# EAGLE design Carrier Board_PIR (EAGLE 8.4.3)

## Sheet 1 of 3: Sensors
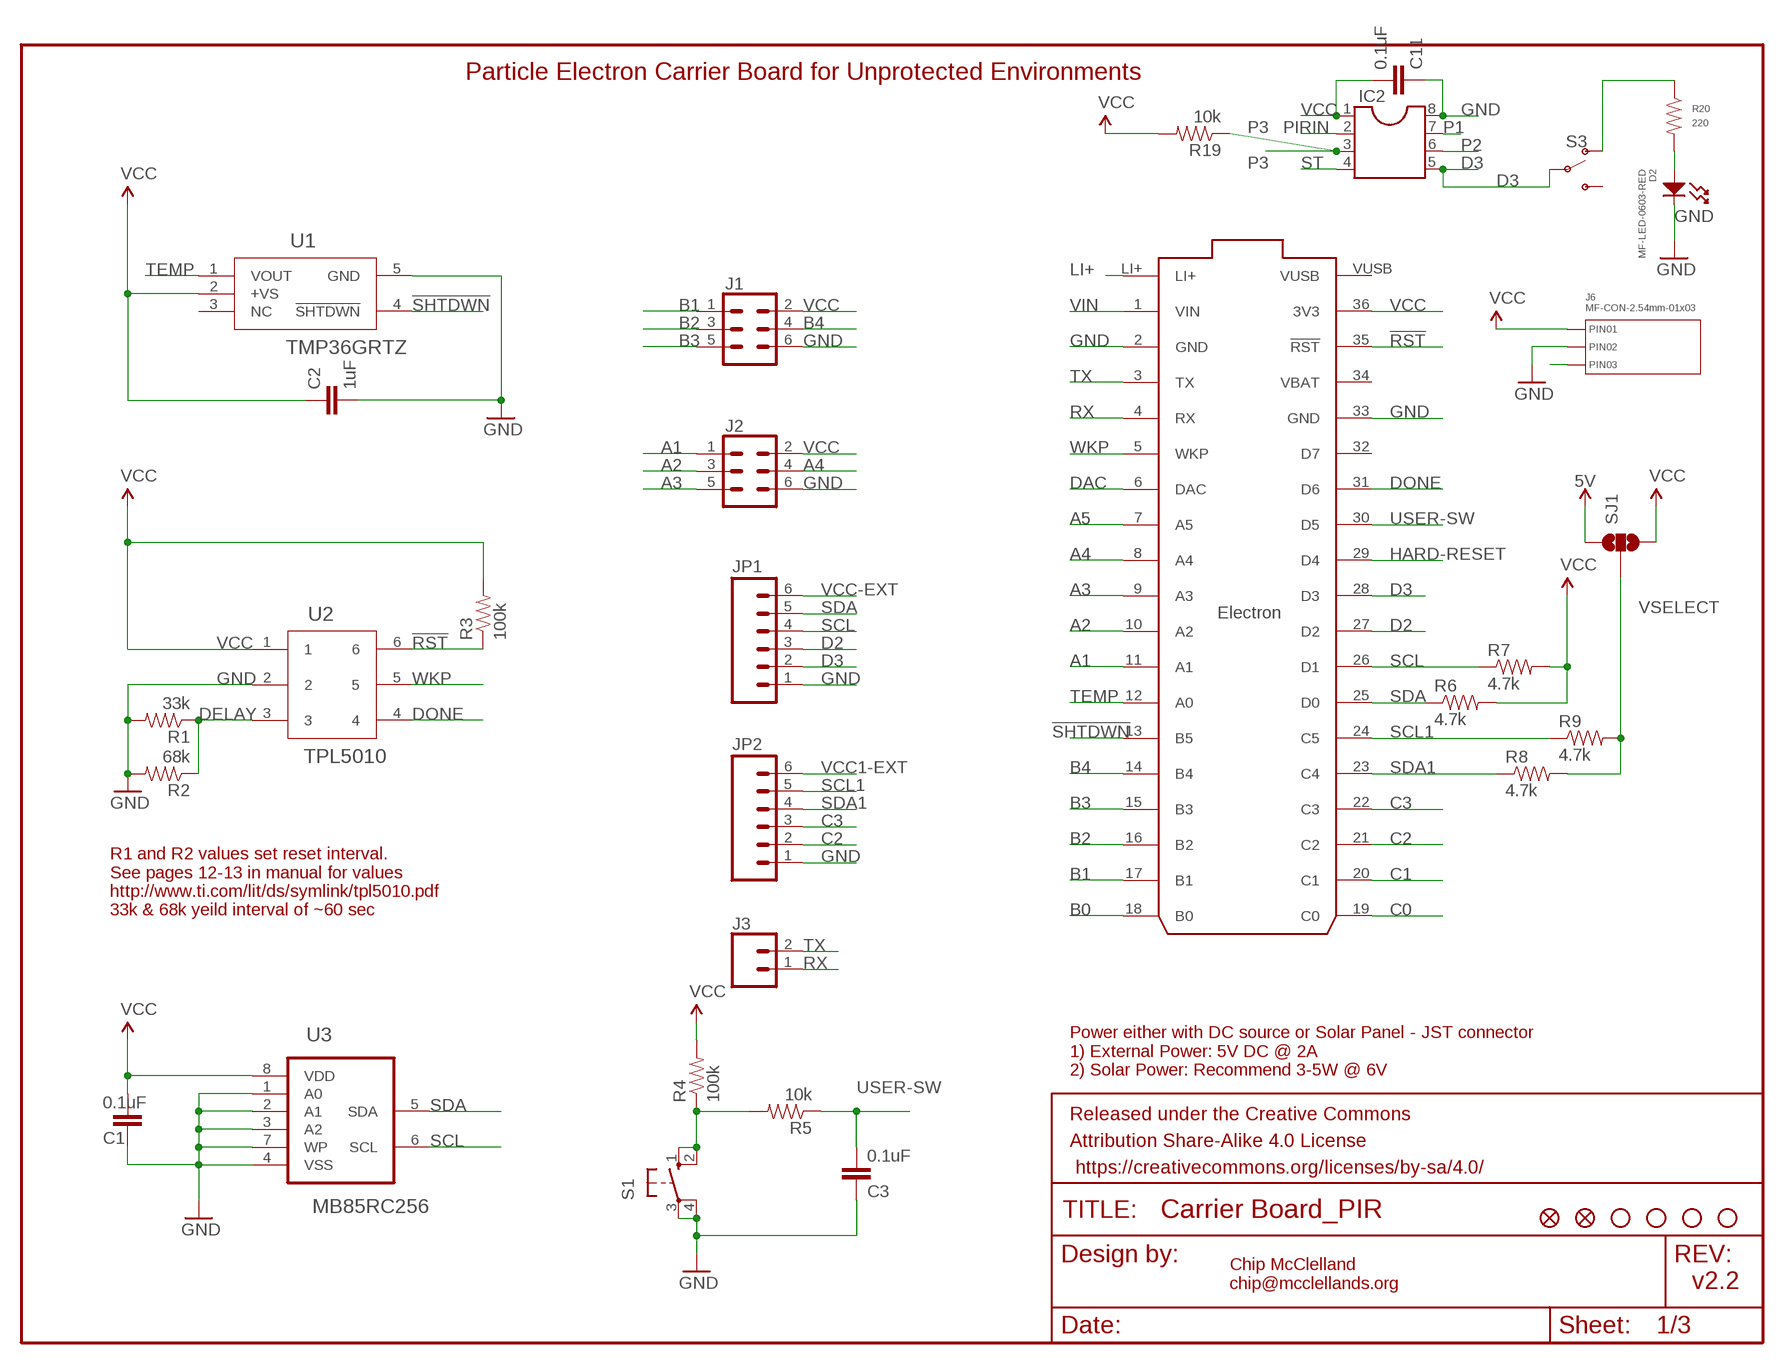
[diagram p0: schematic, sheet 1]

### Parts
C1  0.1uF  CAP0805  [0805]
C2  1uF  CAP0805  [0805]
C3  0.1uF  CAP0805  [0805]
C11  0.1uF  CAP0805  [0805]
D2  MF-LED-0603-RED  LED_SINGLE-0603-RED  [LED0603]
FD1  FIDUCIALUFIDUCIAL  [FIDUCIAL-MICRO]
FD2  FIDUCIALUFIDUCIAL  [FIDUCIAL-MICRO]
FRAME1  FRAME-LETTER  [CREATIVE_COMMONS]
IC2  DIL8S  [SOCKET-08]
J1  CONN_03X22X3_SILK_MALE_PTH  [2X3]
J2  CONN_03X22X3_SILK_MALE_PTH  [2X3]
J3  CONN_02  [1X02]
J6  MF-CON-2.54mm-01x03  CON_01X03_PTH_2.54MM  [PTH_2.54MM_01X03]
JP1  M06LOCK  [1X06_LOCK]
JP2  M06LOCK  [1X06_LOCK]
JP3  STAND-OFF  [STAND-OFF]
JP4  STAND-OFF  [STAND-OFF]
JP5  STAND-OFF  [STAND-OFF]
JP6  STAND-OFF  [STAND-OFF]
R1  33k  RESISTOR0805-RES  [0805]
R2  68k  RESISTOR0805-RES  [0805]
R3  100k  RESISTOR0805-RES  [0805]
R4  100k  RESISTOR0805-RES  [0805]
R5  10k  RESISTOR0805-RES  [0805]
R6  4.7k  RESISTOR0805-RES  [0805]
R7  4.7k  RESISTOR0805-RES  [0805]
R8  4.7k  RESISTOR0805-RES  [0805]
R9  4.7k  RESISTOR0805-RES  [0805]
R19  10k  RESISTOR0805-RES  [0805]
R20  220  RESISTOR_0603  [R0603]
S1  10-XX  [B3F-10XX]
S3  SWITCH-SPDT-SMD-RIGHT-ANGLE  [SWITCH_SPST_SMD_A]
SJ1  SOLDERJUMPER_2WAYPASTE1&2  [SJ_3_PASTE1&2]
U1  TMP36GRTZ  TMP36GRTZ-REEL7  [RJ_5]
U2  TPL5010  [TSOT-23]
U3  MB85RC256  MB85RC128PNF-G-JNE1  [SOIC127P600X175-8N]
U4  Particle Electron  ELECTRON-PWR-PINS  [ELECTON-PWR-PINS]

### Nets
5V: SJ1.1 ; also sheet 3
!RST: R3.1 U2.6 U4.35(!RST)
!SHTDWN: U1.4(!SHTDWN) U4.13(B5)
A1: J2.1 U4.11(A1)
A2: J2.3 U4.10(A2)
A3: J2.5 U4.9(A3)
A4: J2.4 U4.8(A4)
A5: U4.7(A5)
B0: U4.18(B0)
B1: J1.1 U4.17(B1)
B2: J1.3 U4.16(B2)
B3: J1.5 U4.15(B3)
B4: J1.4 U4.14(B4)
C0: U4.19(C0)
C1: U4.20(C1)
C2: JP2.2 U4.21(C2) ; also sheet 3
C3: JP2.3 U4.22(C3) ; also sheet 3
D2: JP1.3 U4.27(D2) ; also sheet 3
D3: IC2.5 JP1.2 S3.2(P) U4.28(D3) ; also sheet 3
DAC: U4.6(DAC)
DELAY: R1.1 R2.1 U2.3
DONE: U2.4 U4.31(D6)
GND: C1.2 C2.2 C3.2 C11.2 D2.CATHODE IC2.8 J1.6 J2.6 J6.P$2(PIN2) JP1.1 JP2.1 R1.2 R2.2 S1.3(P) S1.4(P1) U1.5(GND) U2.2 U3.1(A0) U3.2(A1) U3.3(A2) U3.4(VSS) U3.7(WP) U4.2(GND) U4.33(GND) ; also sheet 2,3
HARD-RESET: U4.29(D4) ; also sheet 2
LI+: U4.LI+ ; also sheet 2
N$4: R4.1 R5.2 S1.1(S) S1.2(S1)
N$5: R20.P$1 S3.1(O)
N$6: D2.ANODE R20.P$2
P1: IC2.7
P2: IC2.6
P3: IC2.3 R19.1
PIRIN: IC2.2 J6.P$3(PIN3)
RX: J3.1 U4.4(RX)
SCL: JP1.4 R7.1 U3.6(SCL) U4.26(D1) ; also sheet 3
SCL1: JP2.5 R9.1 U4.24(C5) ; also sheet 3
SDA: JP1.5 R6.1 U3.5(SDA) U4.25(D0) ; also sheet 3
SDA1: JP2.4 R8.1 U4.23(C4) ; also sheet 3
ST: IC2.4
TEMP: U1.1(VOUT) U4.12(A0)
TX: J3.2 U4.3(TX)
USER-SW: C3.1 R5.1 U4.30(D5)
VCC: C1.1 C2.1 C11.1 IC2.1 J1.2 J2.2 J6.P$1(PIN1) R3.2 R4.2 R6.2 R7.2 R19.2 SJ1.3 U1.2(+VS) U2.1 U3.8(VDD) U4.36(3V3) ; also sheet 3
VCC1-EXT: JP2.6 ; also sheet 3
VCC-EXT: JP1.6 ; also sheet 3
VIN: U4.1(VIN) ; also sheet 2
VSELECT: R8.2 R9.2 SJ1.2 ; also sheet 3
WKP: U2.5 U4.5(WKP)
Unconnected: S3.3(S) U1.3(NC) U4.32(D7) U4.VUSB

### Notes on the sheet
- Particle Electron Carrier Board for Unprotected Environments
- R1 and R2 values set reset interval.
  See pages 12-13 in manual for values
  http://www.ti.com/lit/ds/symlink/tpl5010.pdf
  33k & 68k yeild interval of ~60 sec
- Power either with DC source or Solar Panel - JST connector
  1) External Power: 5V DC @ 2A 
  2) Solar Power: Recommend 3-5W @ 6V
- Chip McClelland
  chip@mcclellands.org
- v2.2

## Sheet 2 of 3: Power Control
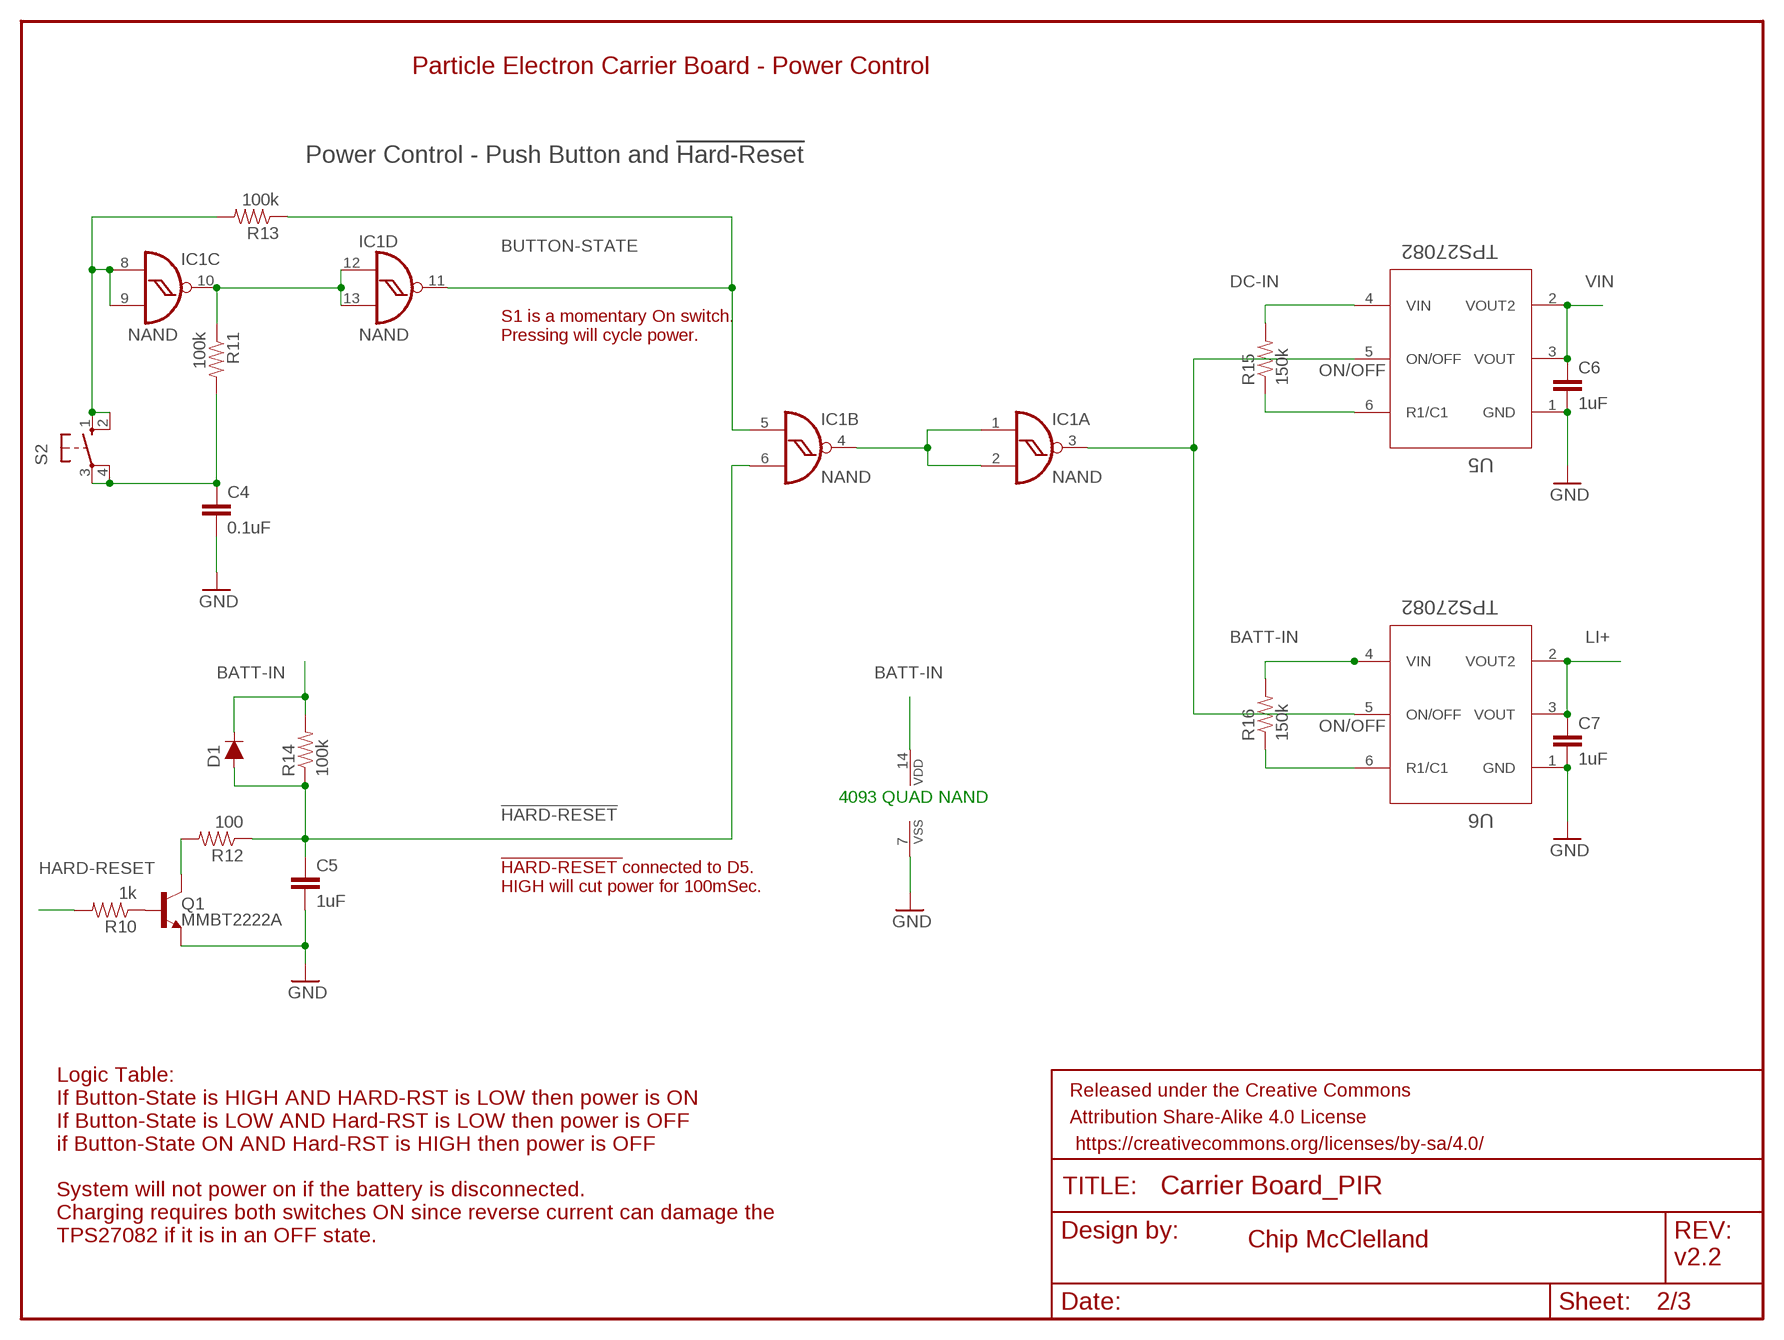
[diagram p1: schematic, sheet 2]

### Parts
C4  0.1uF  CAP0805  [0805]
C5  1uF  CAP0805  [0805]
C6  1uF  CAP0805  [0805]
C7  1uF  CAP0805  [0805]
D1  DIODE-BAS16J  [SOD-323]
FRAME2  FRAME-LETTER  [CREATIVE_COMMONS]
IC1  NAND  4093DT  [MC14093B-TSSOP14]
Q1  MMBT2222A  TRANS_NPN-MMBT2222AL  [SOT23-3]
R10  1k  RESISTOR0805-RES  [0805]
R11  100k  RESISTOR0805-RES  [0805]
R12  100  RESISTOR0805-RES  [0805]
R13  100k  RESISTOR0805-RES  [0805]
R14  100k  RESISTOR0805-RES  [0805]
R15  150k  RESISTOR0805-RES  [0805]
R16  150k  RESISTOR0805-RES  [0805]
S2  40-XX-ROUND  [B3F-40XX-ROUND]
U5  TPS27082  [TSOT-23]
U6  TPS27082  [TSOT-23]

### Nets
!HARD-RESET: C5.1 D1.A IC1.6(B:I1) R12.1 R14.1
BATT-IN: D1.C IC1.14(P:VDD) R14.2 R16.2 U6.4(VIN) ; also sheet 3
BUTTON-STATE: IC1.5(B:I0) IC1.11(D:O) R13.1
DC-IN: R15.2 U5.4(VIN) ; also sheet 3
GND: C4.2 C5.2 C6.2 C7.2 IC1.7(P:VSS) Q1.2(E) U5.1(GND) U6.1(GND) ; also sheet 1,3
HARD-RESET: R10.2 ; also sheet 1
LI+: C7.1 U6.2(VOUT2) U6.3(VOUT) ; also sheet 1
N$1: IC1.1(A:I0) IC1.2(A:I1) IC1.4(B:O)
N$14: IC1.10(C:O) IC1.12(D:I0) IC1.13(D:I1) R11.1
N$15: R15.1 U5.6(R1/C1)
N$16: Q1.1(B) R10.1
N$17: R16.1 U6.6(R1/C1)
N$19: Q1.3(C) R12.2
N$24: C4.1 R11.2 S2.3(P) S2.4(P1)
N$25: IC1.8(C:I0) IC1.9(C:I1) R13.2 S2.1(S) S2.2(S1)
ON/OFF: IC1.3(A:O) U5.5(ON/OFF) U6.5(ON/OFF)
VIN: C6.1 U5.2(VOUT2) U5.3(VOUT) ; also sheet 1

### Notes on the sheet
- Particle Electron Carrier Board - Power Control
- Power Control - Push Button and !Hard-Reset
- S1 is a momentary On switch.
  Pressing will cycle power.
- 4093 QUAD NAND
- !HARD-RESET !connected to D5. 
  HIGH will cut power for 100mSec.
- Chip McClelland
- Logic Table:
  If Button-State is HIGH AND HARD-RST is LOW then power is ON
  If Button-State is LOW AND Hard-RST is LOW then power is OFF
  if Button-State ON AND Hard-RST is HIGH then power is OFF
  
  System will not power on if the battery is disconnected.  
  Charging requires both switches ON since reverse current can damage the
  TPS27082 if it is in an OFF state.
- v2.2

## Sheet 3 of 3: Protection and 5V Boost
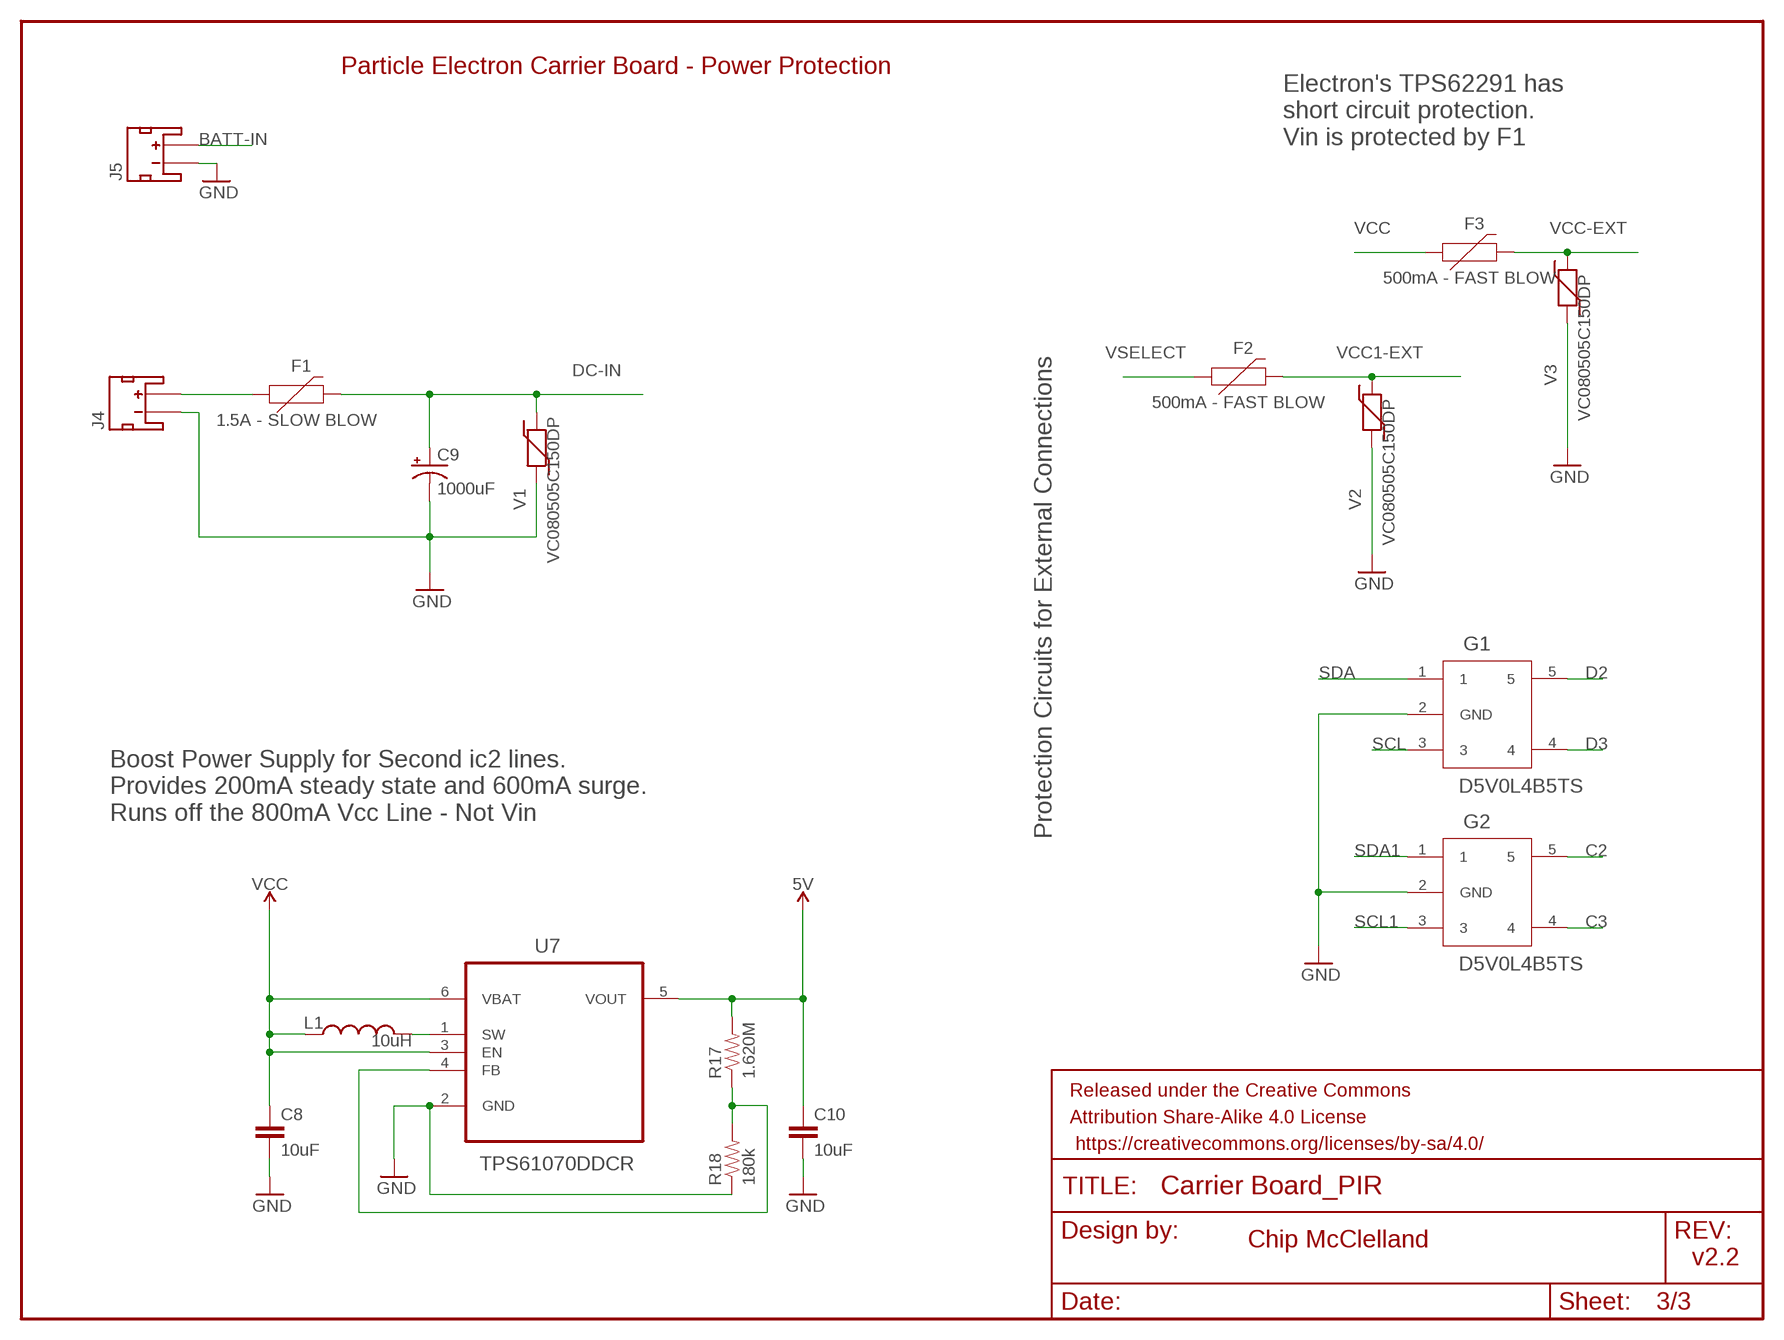
[diagram p2: schematic, sheet 3]

### Parts
C8  10uF  CAP0805  [0805]
C9  1000uF  CAP_POLG  [PANASONIC_G]
C10  10uF  CAP0805  [0805]
F1  1.5A - SLOW BLOW  PPTC_HALF-AMP  [1206]
F2  500mA - FAST BLOW  PPTC_HALF-AMP  [1206]
F3  500mA - FAST BLOW  PPTC_HALF-AMP  [1206]
FRAME3  FRAME-LETTER  [CREATIVE_COMMONS]
G1  D5V0L4B5TS  [SOT-23-5]
G2  D5V0L4B5TS  [SOT-23-5]
J4  5V @ 2A  JST_2MM_MALE  [JST-2-SMD]
J5  JST_2MM_MALE  [JST-2-SMD]
L1  10uH  INDUCTORSDR0403-560KL  [SDR0403]
R17  1.620M  RESISTOR0805-RES  [0805]
R18  180k  RESISTOR0805-RES  [0805]
U7  TPS61070DDCR  [SOT95P280X110-6N]
V1  VC080505C150DP  VARISTOR  [0805]
V2  VC080505C150DP  VARISTOR  [0805]
V3  VC080505C150DP  VARISTOR  [0805]

### Nets
5V: C10.1 R17.2 U7.5(VOUT) ; also sheet 1
BATT-IN: J5.2(+) ; also sheet 2
C2: G2.5 ; also sheet 1
C3: G2.4 ; also sheet 1
D2: G1.5 ; also sheet 1
D3: G1.4 ; also sheet 1
DC-IN: C9.+ F1.2 V1.2 ; also sheet 2
DC-IN-EXT: F1.1 J4.2(+)
GND: C8.2 C9.- C10.2 G1.2(GND) G2.2(GND) J4.1(-) J5.1(-) R18.1 U7.2(GND) V1.1 V2.1 V3.1 ; also sheet 1,2
N$2: R17.1 R18.2 U7.4(FB)
SCL: G1.3 ; also sheet 1
SCL1: G2.3 ; also sheet 1
SDA: G1.1 ; also sheet 1
SDA1: G2.1 ; also sheet 1
SW: L1.P$2 U7.1(SW)
VCC: C8.1 F3.1 L1.P$1 U7.3(EN) U7.6(VBAT) ; also sheet 1
VCC1-EXT: F2.2 V2.2 ; also sheet 1
VCC-EXT: F3.2 V3.2 ; also sheet 1
VSELECT: F2.1 ; also sheet 1
Unconnected: J4.NC1(PAD1) J4.NC2(PAD2) J5.NC1(PAD1) J5.NC2(PAD2)

### Notes on the sheet
- Particle Electron Carrier Board - Power Protection
- Electron's TPS62291 has 
  short circuit protection. 
  Vin is protected by F1
- Boost Power Supply for Second ic2 lines.
  Provides 200mA steady state and 600mA surge. 
  Runs off the 800mA Vcc Line - Not Vin
- Protection Circuits for External Connections
- Chip McClelland
- v2.2

## Power pins joined to a net without a drawn wire
VBAT: U4.34(VBAT)

## Library data of the parts
C1-C8 C10 C11 = SparkFun-Capacitors:CAP: Capacitor Standard 0603 ceramic capacitor, and 0.1" leaded capacitor.
C9 = SparkFun-Capacitors:CAP_POL: Capacitor Polarized These are standard SMD and PTH capacitors. Normally 10uF, 47uF, and 100uF in electrolytic and tantalum varieties. Always verify the external diameter of the through hole cap, it varies with capacity, voltage, and manufacturer. The EIA devices should be standard.
D1 = SparkFun-DiscreteSemi:DIODE: Diode These are standard reverse protection diodes and small signal diodes. SparkFun Products: SparkFun SparkPunk Sound Kit <https://www.sparkfun.com/products/11177> SparkFun ESP8266 Thing <https://www.sparkfun.com/products/13231>; PROD_ID: DIO-09646; VALUE: 250mA/100V
D2 = MF_LEDs:LED_SINGLE: Library: MF_LEDs Description: Device for Single LED Packages. Manufacture part number (MFG#) can be added via Attributes.; HOUSEPART: YES; MPN: MF-LED-0603-RED; POPULATE: 1; URL: https://factory.macrofab.com/part/MF-LED-0603-RED
F1-F3 = SparkFun-Fuses:PPTC: Resettable Fuse PPTC Resettable Fuse. Really a sort of resistor with a polymeric positive temperature coefficient whose resistance increases dramatically with an increase in temperature. When heated by the power passing through the resistance rises causing the current to be limited, protecting the circuit. This is achieved by the transition of the polymer from a crystalline to an amorphous state where the conductive carbon separates breaking the conductive pathways found in the cool crystalline structure. When a PPTC cools back down it resumes conducting letting the circuit turn back on. SparkFun Products: SparkFun RedBoard - Programmed with Arduino <https://www.sparkfun.com/products/12757> Pro Micro - 5V/16MHz <https://www.sparkfun.com/products/12640> Arduino Pro 328 - 5V/16MHz <https://www.sparkfun.com/products/10915> MP3 Trigger <https://www.sparkfun.com/products/13720>; PROD_ID: RES-08585; VALUE: 6V/0.5A
FD1 FD2 = SparkFun-Aesthetics:FIDUCIAL: Fiducial Alignment Points Point-of-reference for pick-and-place machines and other optical instruments.
FRAME1-FRAME3 = SparkFun-Aesthetics:FRAME-LETTER: Schematic Frame - Letter Standard 8.5x11 US Letter frame
G1 G2 = Custom Components:D5V0L4B5TS: 4 CHANNEL LOW CAPACITANCE BI-DIRECTIONAL TVS ARRAY
IC1 = adafruit:4093: Quad 2-input NAND schmitt trigger
IC2 = ic-package:DIL8: Dual In Line / Socket
J1 J2 = SparkFun-Connectors:CONN_03X2: Multi connection point. Often used as Generic Header-pin footprint for 0.1 inch spaced/style header connections You can populate with any combo of single row headers, but if you'd like an exact match, check these: Header - 2x3 (Male, 0.1") <https://www.sparkfun.com/products/12807> (PRT-12807) Header - 2x3 (Female, 0.1") <https://www.sparkfun.com/products/13010> (PRT-13010) 2x3 Pin Shrouded Header <https://www.sparkfun.com/products/10877> (PRT-10877) On any of the 0.1 inch spaced packages, you can populate with these: Break Away Headers - Straight <https://www.sparkfun.com/products/116> (PRT-00116) Break Away Male Headers - Right Angle <https://www.sparkfun.com/products/553> (PRT-00553) Female Headers <https://www.sparkfun.com/products/115> (PRT-00115) Break Away Headers - Machine Pin <https://www.sparkfun.com/products/117> (PRT-00117) Break Away Female Headers - Swiss Machine Pin <https://www.sparkfun.com/products/743> (PRT-00743) Special note: the shrouded connector mates well with our 3x2 ribbon cables: Ribbon Crimp Connector - 6-pin (2x3, Female) <https://www.sparkfun.com/products/10651> (PRT-10651) Ribbon Cable - 6 wire (15ft) <https://www.sparkfun.com/products/10646> (PRT-10646); PROD_ID: CONN-09701
J3 = SparkFun-Connectors:CONN_02: Multi connection point. Often used as Generic Header-pin footprint for 0.1 inch spaced/style header connections On any of the 0.1 inch spaced packages, you can populate with these: Break Away Headers - Straight <https://www.sparkfun.com/products/116> (PRT-00116) Break Away Male Headers - Right Angle <https://www.sparkfun.com/products/553> (PRT-00553) Female Headers <https://www.sparkfun.com/products/115> (PRT-00115) Break Away Headers - Machine Pin <https://www.sparkfun.com/products/117> (PRT-00117) Break Away Female Headers - Swiss Machine Pin <https://www.sparkfun.com/products/743> (PRT-00743) For SCREWTERMINALS and SPRING TERMINALS visit here: Screw Terimnals on SparkFun.com <https://www.sparkfun.com/search/results?term=Screw+Terminals> (5mm/3.5mm/2.54mm spacing) This device is also useful as a general connection point to wire up your design to another part of your project. Our various solder wires solder well into these plated through hole pads. Hook-Up Wire - Assortment (Stranded, 22 AWG) <https://www.sparkfun.com/products/11375> (PRT-11375) Hook-Up Wire - Assortment (Solid Core, 22 AWG) <https://www.sparkfun.com/products/11367> (PRT-11367) View the entire wire category on our website here <https://www.sparkfun.com/categories/141> Special notes: Molex polarized connector foot print use with: PRT-08233 with associated crimp pins and housings. 2.54_SCREWTERM for use with PRT-10571. 3.5mm Screw Terminal footprints for PRT-08084 5mm Screw Terminal footprints for use with PRT-08432
J4 J5 = SparkFun-Connectors:JST_2MM_MALE: JST 2MM MALE RA CONNECTOR Two pin, compact surface mount connector. Commonly used as a battery input connection point. We really like the solid locking feeling and high current rating on these small connectors. We use these all the time as battery connectors. Mates to single-cell LiPo batteries. Here is the connector we sell at SparkFun: JST Right Angle Connector - White <https://www.sparkfun.com/products/8612> (PRT-08612) Datasheet <http://www.sparkfun.com/datasheets/Prototyping/Connectors/JST-Horizontal.pdf> It was used on these SparkFun products: SparkFun MOSFET Power Controller <https://www.sparkfun.com/products/11214> (PRT-11214) SparkFun Battery Babysitter - LiPo Battery Manager <https://www.sparkfun.com/products/13777> (PRT-13777) And many, many others that required a lipo battery connection.; PROD_ID: CONN-11443; SF_ID: PRT-08612
J6 = MF_Connectors:CON_01X03: Library: MF_Connectors Description: Header Connector with 03 Positions and 01 Rows. Use the LABEL Attribute to label the pin on the schematic and PCB. You can remove the attributes on the PCB by using the SMASH function on the part and then deleting the text.; HOUSEPART: YES; MPN: MF-CON-2.54mm-01x03; POPULATE: 1; URL: https://factory.macrofab.com/part/MF-CON-2.54mm-01x03
JP1 JP2 = SparkFun-Connectors:M06: Header 6 Standard 6-pin 0.1" header. Use with straight break away headers (SKU : PRT-00116), right angle break away headers (PRT-00553), swiss pins (PRT-00743), machine pins (PRT-00117), and female headers (PRT-00115). Molex polarized connector foot print use with SKU : PRT-08094 with associated crimp pins and housings. NOTES ON THE VARIANTS LOCK and LOCK_LONGPADS... This footprint was designed to help hold the alignment of a through-hole component (i.e. 6-pin header) while soldering it into place. You may notice that each hole has been shifted either up or down by 0.005 of an inch from it's more standard position (which is a perfectly straight line). This slight alteration caused the pins (the squares in the middle) to touch the edges of the holes. Because they are alternating, it causes a "brace" to hold the component in place. 0.005 has proven to be the perfect amount of "off-center" position when using our standard breakaway headers. Although looks a little odd when you look at the bare footprint, once you have a header in there, the alteration is very hard to notice. Also,if you push a header all the way into place, it is covered up entirely on the bottom side. This idea of altering the position of holes to aid alignment will be further integrated into the Sparkfun Library for other footprints. It can help hold any component with 3 or more connection pins.
JP3-JP6 = SparkFun:STAND-OFF: Stand Off This is the mechanical footprint for a #4 phillips button head screw. Use the keepout ring to avoid running the screw head into surrounding components. SKU : PRT-00447
L1 = SparkFun-Passives:INDUCTOR: Inductors Basic Inductor/Choke - 0603 and 1206. Footprints are not proven and vary greatly between part numbers. SRN6045- 33uH, 20% 1.4A SDR0403-560KL - 56uH, 10%, 500mA RMS/740mA peak; DIST: DIGIKEY; DIST_ID: SDR0403-560KLCT-ND; VALUE: 56uH
Q1 = SparkFun-DiscreteSemi:TRANS_NPN: NPN transistor Current controlled devices typically used to amplify current or used as a switch. BC547 - COM-08928 <http://www.sparkfun.com/products/8928> (TO-92 45V 100mA) (1.Collector 2.Base 3.Emitter) 2N3904 - COM-00521 <http://www.sparkfun.com/products/521> (TO-92 40V 200mA) (1.Emitter 2.Base 3.Collector) P2N2222A - COM-12852 <http://www.sparkfun.com/products/12852> (TO-92 40V 600mA) (1.Collector 2.Base 3.Emitter); PROD_ID: TRANS-08049; VALUE: 600mA/40V
R1-R19 = SparkFun-Passives:RESISTOR: Resistor Basic schematic elements and footprints for 0603, 1206, and PTH resistors.
R20 = MF_Passives:RESISTOR: Library: MF_Passives Description: Device for Resistors. Manufacture part number (MPN), Voltage, Tolerance, and Wattage Rating can be added via Attributes. Check https://factory.macrofab.com/parts for the house parts list.; POPULATE: 1
S1 = switch-omron:10-XX: OMRON SWITCH
S2 = adafruit:40-XX: OMRON SWITCH
S3 = SparkFun-Switches:SWITCH-SPDT: Single Pole, Double Throw (SPDT) Switch Single-pole, double-throw (SPDT) switch. Variant Overview SMD-AYZ0202 Surface Mount DPDT Switch <https://www.sparkfun.com/products/597> (COM-00597) Used on e.g. LilyPad Arduino USB - ATmega32U4 Board <https://www.sparkfun.com/products/12049> PTH-11.6X4.0MM SPDT Mini Power Switch <https://www.sparkfun.com/products/102> (COM-00102) Used on e.g. SparkFun Simon Says - Through-Hole Soldering Kit <https://www.sparkfun.com/products/10547> (KIT-10547) PTH-11.6X4.0MM-KIT KIT version of SPDT Mini Power Switch - Simplifies soldering by removing tStop of switch pins - only one side can be soldered. PTH-11.6X4.0MM-LOCK LOCK version of SPDT Mini Power Switch - Offset pins hold switch in place for easier soldering. SMD-RIGHT-ANGLE Surface Mount Right Angle Switch <https://www.sparkfun.com/products/10860> (COM-10860) Used on e.g. SparkFun ESP8266 Thing <https://www.sparkfun.com/products/13231>; PROD_ID: SWCH-10651; SF_SKU: COM-10860
SJ1 = SparkFun-Passives:SOLDERJUMPER_2WAY: Solder Jumper 2 way solder jumper
U1 = TMP36:TMP36GRTZ-REEL7; MANUFACTURER_PART_NUMBER: TMP36GRTZREEL7; VENDOR: Analog Devices Inc
U2 = Custom Components:TPL5010
U3 = Fujitsu_By_element14_Batch_1:MB85RC128PNF-G-JNE1: Memory FRAM; MPN: MB85RC128PNF-G-JNE1; OC_FARNELL: 1831995; OC_NEWARK: 93R5161; PACKAGE: SO-8; SUPPLIER: FUJITSU
U4 = Particle-Devices:ELECTRON-PWR-PINS: This is a Electron pinout with the two power pins populated
U5 U6 = Custom Components:TPS27082: TI TPS27082 Single High-Side On-Off Switch
U7 = Texas Instruments_By_element14_Batch_1:TPS61070DDCR: SYNCHRONOUS BOOST CONVERTER; MPN: TPS61070DDCR; OC_FARNELL: 1461062; OC_NEWARK: 64M3125; PACKAGE: SOT-23-6; SUPPLIER: Texas Instruments
V1-V3 = Custom Components:VARISTOR

## Net classes
0 default: width 0.203 mm, drill 0.33 mm

## Board
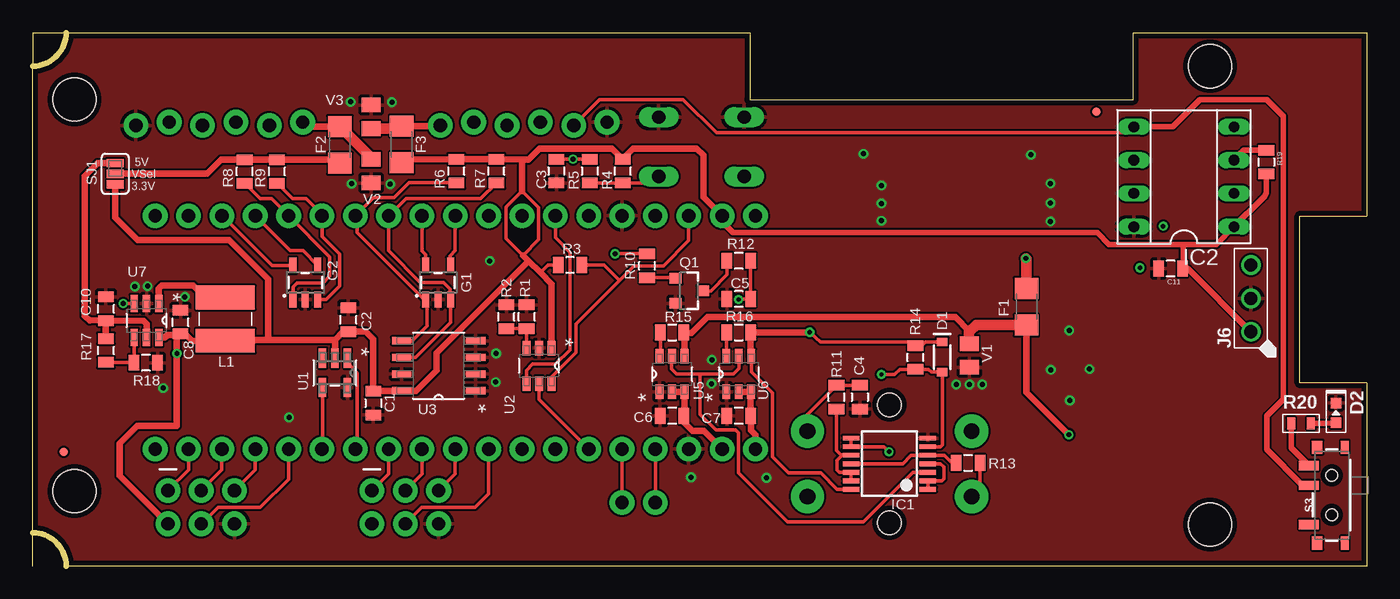
[diagram p3: board, top side]
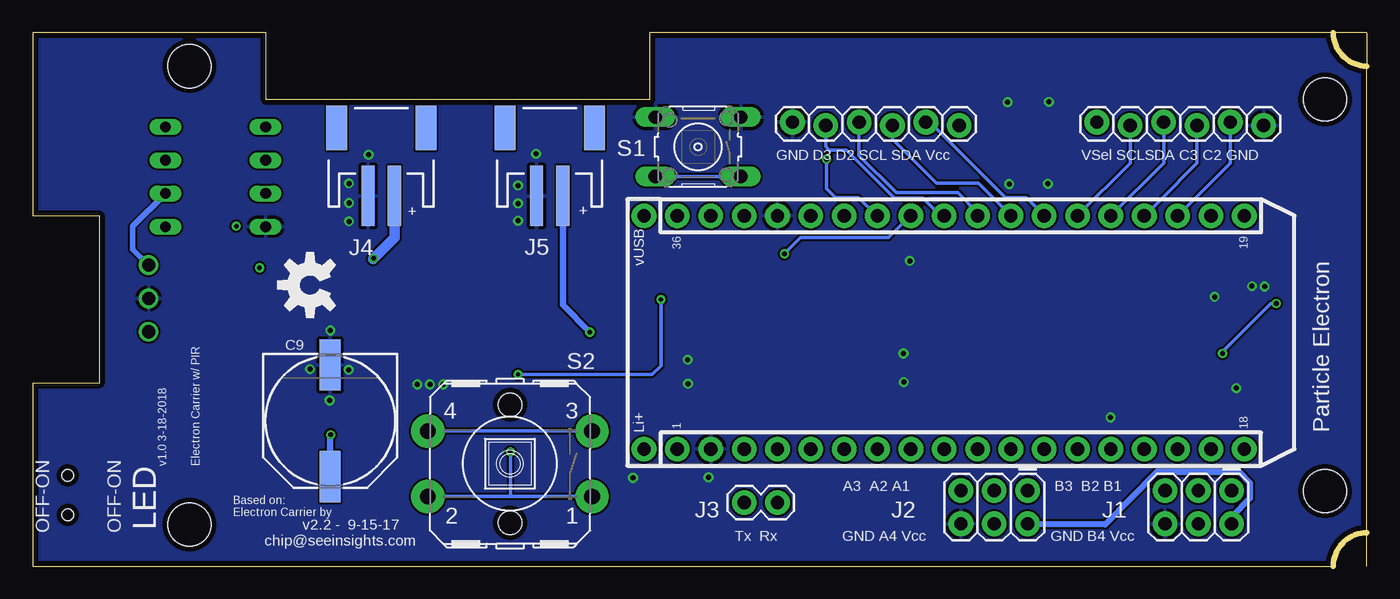
[diagram p4: board, bottom side, seen from below]

Size 101.6 x 40.64 mm. Coordinates in mm from the lower left corner, seen from the top.
Outline: 0,40.62 0,38.1
Outline: 0,0 0,2.54
Outline: 0,2.54 0,38.1
Outline: 0,40.64 2.54,40.64
Outline: 2.54,40.64 54.61,40.64 54.61,35.56 83.82,35.56 83.82,40.64 101.6,40.64 101.6,26.67 96.52,26.67 96.52,13.97 101.6,13.97 101.6,0 2.54,0 arc90 0,2.54
Outline: 0,38.1 arc90 2.54,40.64
Copper layers (1*16): Top 0.0356mm / dielectric 1.5011mm / Bottom 0.0356mm
Design rules "LaenPCBOrder": minimum track width 6mil, minimum drill 13mil, track to track 6mil, track to pad 6mil, pad to pad 6mil, via to via 6mil, smd to smd 6mil, copper to edge 15mil, drill to drill 6mil, minimum pad ring 7mil, minimum via ring 7mil, stop-mask expansion 3mil, vias tented up to drill 0mil, thermal gap 10mil

### Footprints (pad centres in the part's own frame; a part is rotated, then mirrored left to right if it is on the bottom)
0805 = smd 0.8 x 1.2: 1 -0.9,0; 2 0.9,0
PANASONIC_G = smd 3.9 x 1.6: + 4.25,0; - -4.25,0
SOD-323 = smd 0.63 x 0.83: A 1.15,0; C -1.15,0
LED0603 = smd 0.8 x 0.8: ANODE 0.75,0; CATHODE -0.75,0
1206 = smd 1.6 x 1.8: 1 -1.4,0; 2 1.4,0
FIDUCIAL-MICRO = smd 0.635 x 0.635: 1 0,0
SOT-23-5 = smd 0.55 x 1.2: 1 -0.95,-1.3; 2 0,-1.3; 3 0.95,-1.3; 4 0.95,1.3; 5 -0.95,1.3
MC14093B-TSSOP14 = smd 0.36 x 1.26: 1 -1.95,-2.925; 2 -1.3,-2.925; 3 -0.65,-2.925; 4 0,-2.925; 5 0.65,-2.925; 6 1.3,-2.925; 7 1.95,-2.925; 8 1.95,2.925; 9 1.3,2.925; 10 0.65,2.925; 11 0,2.925; 12 -0.65,2.925; 13 -1.3,2.925; 14 -1.95,2.925
SOCKET-08 = drill 0.813 long: 1 -3.81,-3.81; 2 -1.27,-3.81; 3 1.27,-3.81; 4 3.81,-3.81; 5 3.81,3.81; 6 1.27,3.81; 7 -1.27,3.81; 8 -3.81,3.81
2X3 = drill 1.016 pad 1.88: 1 0,0; 2 0,2.54; 3 2.54,0; 4 2.54,2.54; 5 5.08,0; 6 5.08,2.54
1X02 = drill 1.016 pad 1.88: 1 0,0; 2 2.54,0
JST-2-SMD = smd 1 x 4.6: 1 -1,-3.7; 2 1,-3.7 | smd 1.6 x 3.4: NC1 -3.4,1.5; NC2 3.4,1.5
PTH_2.54MM_01X03 = drill 1: P$1 -2.54,0; P$2 0,0; P$3 2.54,0
1X06_LOCK = drill 1.016 pad 1.88: 1 0,0; 2 2.54,-0.254; 3 5.08,0; 4 7.62,-0.254; 5 10.16,0; 6 12.7,-0.254
STAND-OFF = hole 3.302: 0,0
SDR0403 = smd 1.8 x 4.5: P$1 -1.65,0; P$2 1.65,0
SOT23-3 = smd 0.8 x 0.9: 1 -0.95,-1; 2 0.95,-1; 3 0,1.1
R0603 = smd 0.6 x 0.9: P$1 -0.75,0; P$2 0.75,0
B3F-10XX = drill 1.016 long: 1 -3.251,2.261; 2 3.251,2.261; 3 -3.251,-2.261; 4 3.251,-2.261
B3F-40XX-ROUND = drill 1.194 pad 2.54: 1 -6.248,2.489; 2 6.248,2.489; 3 -6.248,-2.489; 4 6.248,-2.489 | hole 1.803: 0,-4.496; 0,4.496
SWITCH_SPST_SMD_A = smd 0.7 x 1.5: 1 -2.25,-1.75; 2 -0.75,-1.75; 3 2.25,-1.75 | smd 1 x 0.6: GND1 -3.65,1; GND3 3.65,1 | smd 1 x 0.8: GND2 -3.65,-1.1; GND4 3.65,-1.1 | hole 0.9: -1.5,0; 1.5,0
SJ_3_PASTE1&2 = smd 0.635 x 1.27: 1 -0.813,0; 2 0,0; 3 0.813,0
RJ_5 = smd 1.473 x 0.559: 1 -1.118,0.95; 2 -1.118,0; 3 -1.118,-0.95; 4 1.118,-0.95; 5 1.118,0.95
TSOT-23 = smd 1.1 x 0.6: 1 -1.35,0.95; 2 -1.35,0; 3 -1.35,-0.94; 4 1.35,-0.95; 5 1.35,0; 6 1.35,0.95
SOIC127P600X175-8N = smd 1.473 x 0.559: 1 -2.819,1.905; 2 -2.819,0.635; 3 -2.819,-0.635; 4 -2.819,-1.905; 5 2.819,-1.905; 6 2.819,-0.635; 7 2.819,0.635; 8 2.819,1.905
ELECTON-PWR-PINS = drill 1.016 pad 1.88: 1 2.54,46.99; 2 2.54,44.45; 3 2.54,41.91; 4 2.54,39.37; 5 2.54,36.83; 6 2.54,34.29; 7 2.54,31.75; 8 2.54,29.21; 9 2.54,26.67; 10 2.54,24.13; 11 2.54,21.59; 12 2.54,19.05; 13 2.54,16.51; 14 2.54,13.97; 15 2.54,11.43; 16 2.54,8.89; 17 2.54,6.35; 18 2.54,3.81; 19 20.32,3.81; 20 20.32,6.35; 21 20.32,8.89; 22 20.32,11.43; 23 20.32,13.97; 24 20.32,16.51; 25 20.32,19.05; 26 20.32,21.59; 27 20.32,24.13; 28 20.32,26.67; 29 20.32,29.21; 30 20.32,31.75; 31 20.32,34.29; 32 20.32,36.83; 33 20.32,39.37; 34 20.32,41.91; 35 20.32,44.45; 36 20.32,46.99; LI+ 2.54,49.53; VUSB 20.32,49.53
SOT95P280X110-6N = smd 1.321 x 0.559: 1 -1.295,0.94; 2 -1.295,0; 3 -1.295,-0.94; 4 1.295,-0.94; 5 1.295,0; 6 1.295,0.94
0805' = smd 1.118 x 1.448: 1 -0.902,0; 2 0.902,0

### Placement (x,y rotation side)
C1  25.93,12.42 270 top
C2  24.03,18.77 90 top
C3  39.88,30.1 270 top
C4  62.99,12.88 270 top
C5  53.77,20.35 180 top
C6  48.69,11.46 180 top
C7  53.77,11.46 180 top
C8  11.25,18.59 90 top
C9  78.94,11.07 270 bottom
C10  5.56,19.61 90 top
C11  86.66,22.68 180 top
D1  69.27,15.93 270 top
D2  99.26,11.68 270 top
F1  75.69,19.76 270 top
F2  23.39,32.11 90 top
F3  28.09,32.13 90 top
FD1  81.03,34.62 0 top
FD2  2.36,8.69 0 top
FRAME1  0.03,-10.54 0 top  (outside the outline)
FRAME2  0.03,-20.29 0 top  (outside the outline)
FRAME3  0.03,-28.78 0 top  (outside the outline)
G1  30.86,21.62 0 top
G2  20.75,21.62 0 top
IC1  65.25,7.8 90 top
IC2  87.68,29.67 90 top
J1  10.29,5.77 180 bottom
J2  25.83,5.77 180 bottom
J3  44.88,4.85 180 bottom
J4  75.06,31.9 0 bottom
J5  62.23,31.9 0 bottom
J6  92.79,20.4 90 top
JP1  43.74,33.83 0 bottom
JP2  7.85,33.58 180 bottom
JP3  89.66,38.1 0 top
JP4  89.66,3.17 90 top
JP5  3.17,35.56 0 top
JP6  3.17,5.71 0 top
L1  14.66,18.82 90 top
Q1  49.96,20.98 270 top
R1  37.62,19 90 top
R2  36.07,19 90 top
R3  40.92,22.94 180 top
R4  44.93,30.1 90 top
R5  42.42,30.1 270 top
R6  32.26,30.1 90 top
R7  35.31,30.1 90 top
R8  16.13,30.07 90 top
R9  18.59,30.07 90 top
R10  46.79,22.89 90 top
R11  61.21,12.88 90 top
R12  53.77,23.27 180 top
R13  71.25,7.87 0 top
R14  67.23,15.9 90 top
R15  48.69,17.81 0 top
R16  53.77,17.81 0 top
R17  5.56,16.43 90 top
R18  8.61,15.49 180 top
R19  93.95,30.78 270 top
R20  96.6,10.87 0 top
S1  50.93,31.95 180 bottom
S2  65.25,7.8 180 bottom
S3  98.93,5.41 270 top
SJ1  6.27,29.9 270 top
U1  23.01,14.73 270 top
U2  38.56,15.27 270 top
U3  30.91,15.27 180 top
U4  5.51,6.38 90 bottom
U5  48.69,14.63 90 top
U6  53.77,14.63 90 top
U7  8.66,18.72 270 top
U$2  [OSHW-LOGO-M]  80.49,21.41 90 bottom
V1  VC080505C150DP  [0805']  71.32,16.05 90 top
V2  VC080505C150DP  [0805']  25.76,30.1 90 top
V3  VC080505C150DP  [0805']  25.76,34.24 270 top

### Tracks (layer width: path | path; a pad name or v marks a point on that pad's centre or on a via)
5V
  Top 0.508: U7.5 8.66,18.47 8.43,18.69 5.57,18.72 | 5.57,18.72 C10.1 R17.2 | SJ1.1 4.95,30.71 3.96,29.72 3.96,19.07 4.32,18.72 5.55,18.75 5.57,18.72
!HARD-RESET  (via drill 0.33)
  Top 0.254: R12.1 C5.1 53.77,20.34 v53.77,20.32 | v64.64,14.61 65.63,14.61 66.03,15 R14.1 | 67.22,14.99 R14.1 | R14.1 68.21,15 68.43,14.78 D1.A 69.27,9.25 69.12,9.1 IC1.6
  Bottom 0.254: v53.77,20.32 53.77,15.27 54.43,14.61 v64.64,14.61
!RST
  Top 0.254: U4.35 49.96,24.79 48.03,22.86 45.8,22.86 44.7,21.76 | U2.6 39.51,14.43 41.38,16.3 41.38,18.44 44.7,21.76 | R3.1 43.52,22.94 44.7,21.76
!SHTDWN
  Top 0.254: U1.4 22.06,8.96 U4.13
A1
  Top 0.254: U4.11 27.1,7.01 J2.1
A2
  Top 0.254: U4.10 29.64,7.01 J2.3
A3
  Top 0.254: U4.9 32.18,7.01 J2.5
A4
  Top 0.254: U4.8 34.72,5.51 33.71,4.5 29.62,4.5 J2.4
B1
  Top 0.254: U4.17 11.86,7.32 J1.1
B2
  Top 0.254: U4.16 14.4,7.32 J1.3
B3
  Top 0.254: U4.15 16.94,7.32 J1.5
B4
  Top 0.254: U4.14 19.48,6.63 17.3,4.5 14.12,4.5 J1.4
BATT-IN  (via drill 0.35)
  Top 0.254: U6.4 54.66,16.05 | 59.21,17.8 59.99,17.08 66.96,17.08 R14.2 67.73,16.8 68,17.07 69.26,17.07 D1.C | 54.67,16.03 54.74,15.96 54.74,14.78 56.34,13.18 56.34,8.33 57.56,7.11 60.02,7.11 61.27,5.87 62.31,5.87 IC1.14
  Top 0.508: U6.4 54.67,16.03 R16.2 59.21,17.8 v59.18,17.83
  Bottom 0.508: J5.2 61.23,19.88 v59.18,17.83
BUTTON-STATE
  Top 0.254: IC1.11 66.27,7.8 66.9,8.43 68.16,8.43 | 68.16,8.43 IC1.5 | R13.1 70,7.87 69.44,8.43 68.16,8.43
C2
  Top 0.254: 19.68,23.14 G2.5 18.21,22.91 14.43,26.7 U4.21
  Bottom 0.254: U4.21 14.3,26.8 13.13,27.96 10.39,30.71 JP2.2
C3
  Top 0.254: 21.7,23.23 G2.4 20.59,24.03 19.61,24.03 U4.22
  Bottom 0.254: U4.22 16.68,26.96 15.7,27.94 12.93,30.71 JP2.3
D2
  Top 0.254: U4.27 29.64,24 29.92,23.72 G1.5
  Bottom 0.254: 29.67,26.7 U4.27 29.64,26.95 31.14,28.45 35.81,28.45 38.66,31.29 JP1.3
D3
  Top 0.254: U4.28 32.18,24.03 31.8,23.65 G1.4 | JP1.2 43.18,35.56 49.53,35.56 52.07,33.02 83.41,33.02 IC2.5
  Top 0.406: IC2.5 86.82,33.48 88.9,35.56 93.98,35.56 95.25,34.29 95.25,12.7 93.98,11.43 93.98,8.89 96.71,6.16 S3.2
  Bottom 0.254: U4.28 32.46,26.7 33.81,28.04 35.98,28.04 39.06,31.12 39.06,31.14 39.62,31.7 40.95,31.7 41.2,31.95 JP1.2
DC-IN  (via drill 0.35)
  Top 0.254: 49.63,16.05 U5.4 | 49.63,17.65 R15.2
  Top 0.508: U5.4 49.64,17.75 | 49.64,17.75 R15.2 | 49.64,17.75 50.17,17.75 51.38,18.97 70.26,18.97 71.35,17.88 | F1.2 75.69,13.23 v78.92,10.01 78.94,9.98
  Top 0.813: F1.2 75.66,18.39 71.86,18.39 71.35,17.88 71.3,17.83 71.3,16.98 V1.2
  Bottom 0.508: C9.+ 78.94,9.98 v78.92,10.01
DC-IN-EXT  (via drill 0.35)
  Top 0.813: F1.1 75.69,23.39 v75.64,23.44
  Bottom 0.813: J4.2 74.06,25.03 v75.64,23.44 75.67,23.42
DELAY
  Top 0.254: U2.3 R1.1 R2.1
DONE
  Top 0.254: U4.31 39.8,25.02 40.92,23.9 40.92,16.48 39.83,15.39 38.08,15.39 37.59,14.91 37.59,13.93 U2.4
GND  (via drill 0.38)
  other vias: 19.51,11.33 35.28,16.21 35.26,14.02 51.69,13.89 64.64,29.01 63.27,31.42 64.64,27.64 64.64,26.31 76.02,31.34 77.52,29.16 77.52,27.66 77.52,26.26 34.8,23.27 55.88,6.73 78.94,17.96 78.99,12.62 80.49,15.01 77.55,14.96 51.71,15.72 27.36,35.36 24.28,29.13 27.23,29.11 72.31,13.84 70.33,13.84 71.35,13.84 50.14,6.76 11.58,20.52 9.93,13.56 8.74,21.34 7.77,21.31 24.21,35.38
  pour Top (rank 2): -3.78,42.37 101.85,42.55 101.8,-0.74 -3.78,-0.53
  pour Bottom: -4.39,43.38 102.74,43.23 102.57,-1.14 -4.22,-1.12
HARD-RESET  (via drill 0.35)
  Top 0.254: v44.35,23.8 46.77,23.8 R10.2
  Bottom 0.254: U4.29 34.75,26.7 36.42,25.02 43.13,25.02 v44.35,23.8
LI+
  Top 0.254: U6.2 53.98,13.31 | 54.66,13.31 U6.3 54.66,13.08 | 54.66,11.48 C7.1
  Top 0.508: U4.LI+ 55.04,9.98 54.69,10.34 54.69,11.46 54.66,11.48 | C7.1 54.67,13.24 U6.3 U6.2
N$1
  Top 0.254: IC1.1 IC1.2 69.24,6.5 69.39,6.66 69.39,7.54 69.14,7.8 IC1.4
N$2
  Top 0.254: R17.1 7.7,15.51 R18.2 U7.4
N$4
  Top 0.254: S1.1 47.18,29.2 R4.1 R5.2
  Bottom 0.254: S1.1 S1.2
N$5
  Top 0.406: S3.1 95.85,9 R20.P$1
N$6
  Top 0.406: R20.P$2 98.44,10.87 D2.ANODE
N$7  (via drill 0.35)
  other vias: 84.33,22.73
N$8  (via drill 0.35)
  other vias: 86.11,25.91
N$14
  Top 0.254: 62.35,6.48 IC1.13 IC1.12 62.32,7.14 61.44,7.14 61.24,7.34 61.24,8.05 61.63,8.45 IC1.10 62.32,8.46 61.57,8.46 61.21,8.81 R11.1
N$15
  Top 0.254: U5.6 47.8,16.05 47.8,17.65 R15.1
N$16
  Top 0.254: Q1.1 48.95,22 46.89,22 R10.1
N$17
  Top 0.254: U6.6 52.83,16.05 52.83,17.65 R16.1
N$19
  Top 0.254: 51.23,21.08 Q1.3 51.64,20.98 52.88,22.23 52.88,23.25 R12.2
N$24
  Top 0.254: S2.3 59,11.57 R11.2 C4.1
  Bottom 0.254: S2.4 S2.3
N$25  (via drill 0.33)
  Top 0.254: IC1.8 IC1.9 64.84,9.1 v65.23,8.71 65.28,8.66 | R13.2 72.15,5.96 S2.2
  Bottom 0.254: 65.18,5.31 S2.2 | 65.18,5.31 S2.1 | v65.23,8.71 65.23,5.35 65.18,5.31
ON/OFF
  Top 0.254: IC1.3 67.04,7.15 63.27,3.38 57.48,3.38 53.75,7.11 53.75,10.13 53.52,10.36 52.02,10.36 50.83,11.56 50.83,14.66 | U6.5 53.77,15.06 53.37,14.66 50.83,14.66 | 50.83,14.66 49.05,14.66 48.67,15.04 48.67,15.96 U5.5 | 50.83,14.66
P3
  Top 0.406: IC2.3 92.24,31.68 R19.1
PIRIN
  Bottom 0.406: IC2.2 93.98,25.91 93.98,24.13 J6.P$3
RX
  Top 0.254: U4.4 J3.1
SCL
  Top 0.254: U3.6 29.16,15.9 31.81,18.55 G1.3 31.8,20.17 31.8,21.11 31.29,21.61 29.52,21.61 27.1,24.03 U4.26 28.42,28.02 34.12,28.02 R7.1
  Bottom 0.254: JP1.4 36.12,32.54 32.77,29.18 29.59,29.18 U4.26
SCL1
  Top 0.254: 21.74,20.4 G2.3 22.33,20.32 23.37,21.36 23.37,23.77 22.02,25.12 U4.24 22.02,26.77 20.8,27.99 19.78,27.99 R9.1
  Bottom 0.254: JP2.5 18.01,30.71 U4.24
SDA
  Top 0.254: U3.5 28.88,17.17 30.02,18.31 30.02,20.2 G1.1 29.8,20.32 24.69,25.43 24.69,26.57 U4.25 25.94,28.08 25.95,28.07 27.51,28.07 28.65,29.21 32.25,29.21 R6.1
  Bottom 0.254: JP1.5 33.27,33.83 27.51,28.07 25.93,28.07 U4.25
SDA1
  Top 0.254: G2.1 19.81,20.33 19.81,21.26 20.14,21.59 22.1,21.59 22.61,22.1 22.61,23.57 U4.23 18.19,27.99 17.31,27.99 R8.1
  Bottom 0.254: JP2.4 15.47,30.71 U4.23
SW
  Top 0.508: 13.14,20.47 L1.P$2 | 13.14,20.47 12.9,20.47 | 13.14,20.47 12.22,21.39 9.83,21.39 9.6,21.16 U7.1
TEMP
  Top 0.254: U1.1 23.96,15.48 24.71,14.73 24.71,9.07 U4.12
TX
  Top 0.254: U4.3 J3.2
USER-SW  (via drill 0.35)
  Top 0.254: R5.1 C3.1 | R5.1 42.15,31 | v41.15,31.01 42.4,31.01 R5.1
  Bottom 0.254: U4.30 37.31,26.7 38.71,28.09 40.46,28.09 41.15,28.78 v41.15,31.01
VCC  (via drill 0.35)
  Top 0.254: 27.91,13.31 U3.8 | 37.24,23.77 36.04,24.97 36.04,27.36 37.26,28.57 38.53,27.3 38.53,24.87 37.34,23.67 | R3.2 39.24,22.94 38.66,22.36 | U7.3 v6.88,20.02 6.81,20.02
  Top 0.406: U4.36 52.5,26.24 53.34,25.4 81.08,25.4 81.97,24.51 87.63,24.51 | 87.63,24.51 90.14,24.51 IC2.1 93.57,27.94 93.85,28.19 93.95,28.47 R19.2 | J6.P$1 87.96,22.68 C11.1 arc45 87.63,22.84 87.63,24.51
  Top 0.508: U4.36 51.08,28.12 51.08,31.32 50.57,31.83 45.72,31.83 44.91,31.02 | 37.28,30.99 R7.2 R6.2 28.34,30.99 F3.1 28.26,30.97 | 37.76,23.25 37.34,23.67 | 37.76,23.25 38.66,22.36 39.5,21.51 39.5,16.63 U2.1 | 37.26,28.57 37.26,30.75 37.28,30.99 | 37.76,23.25 30.76,16.25 30.76,14.91 29.21,13.36 U3.8 25.97,13.36 C1.1 25.93,17.3 25.35,17.88 24.04,17.88 C2.1 23.64,17.87 23.01,17.25 | J1.2 6.63,6.88 6.63,9.35 7.95,10.67 10.97,10.67 v10.97,16.2 10.97,17.41 C8.1 | U1.2 23,15.86 23.01,15.88 23.01,17.25 | 17.95,17.25 23.01,17.25 | 16.9,17.25 17.95,17.25 | 16.9,17.25 16.46,17.25 16.41,17.3 | SJ1.3 6.27,26.54 7.98,24.84 14.96,24.84 17.93,21.87 17.93,17.27 17.95,17.25 | U7.6 10.06,17.42 10.26,17.63 11.19,17.63 C8.1 | C8.1 11.62,17.69 12.14,17.17 L1.P$1 16.82,17.17 16.9,17.25 | 37.28,30.99 37.74,30.99 38.58,31.83 44.1,31.83 44.91,31.02 | 44.91,31.02 R4.2
  Bottom 0.254: v6.88,20.02 7.29,20.02 11,16.31 11,16.23 v10.97,16.2
  Bottom 0.508: J2.2 19.91,3.2 15.98,7.16 9.7,7.16 8.89,6.34 8.89,5.16 10.29,3.77 J1.2
VCC1-EXT
  Top 0.508: F2.2 20.88,33.51 JP2.6
  Top 0.813: V2.2 25.76,31.14 F2.2
VCC-EXT
  Top 0.508: F3.2 30.99,33.53 JP1.6
  Top 0.813: V3.2 27.9,33.34 F3.2
VIN
  Top 0.254: 48.72,13.31 U5.2 | 49.63,13.31 U5.3 | 49.63,11.48 C6.1
  Top 0.508: C6.1 49.59,10.96 50.24,10.31 51.1,10.31 U4.1 | 49.63,11.48 U5.3 U5.2
VSELECT
  Top 0.508: SJ1.2 13.28,29.9 14.35,30.96 16.12,30.96 R8.2 R9.2 23.25,30.97 F2.1
WKP
  Top 0.254: U2.5 38.56,12.7 U4.5

### Text on the board
bPlace: Electron Carrier w/ PIR | v1.0 3-18-2018 | LED | OFF-ON | OFF-ON | Based on: / Electron Carrier by
tNames: 5V / VSel / 3.3V
bNames: VSel SCLSDA C3 C2 GND | GND D3 D2 SCL SDA Vcc | + | + | B3 B2 B1 | A3 A2 A1 | v2.2 - 9-15-17 | GND B4 Vcc | GND A4 Vcc | Tx Rx | chip@seeinsights.com